# Altium schematic sheet Capstone_Signal_Conditioners_Subsystem_Test_Schematic.SchDoc
size A; SheetNumber: 11; SheetTotal: 15
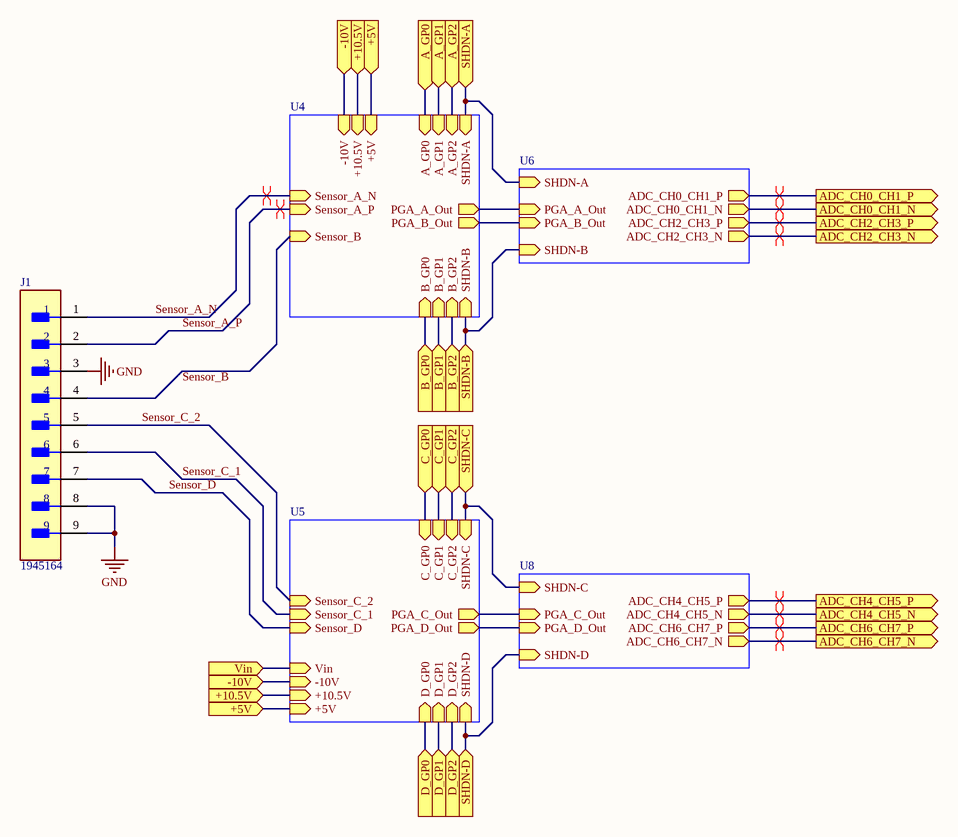
[diagram p0: Capstone_Signal_Conditioners_Subsystem_Test_Schematic.SchDoc]

## Parts
J1  1945164  [1945164]

## Sub-sheets
U4 = THS7002CPWP_Schematic.SchDoc: Sensor_A_P (in), Sensor_A_N (in), A_GP0 (in), A_GP1 (in), A_GP2 (in), PGA_A_Out (out), PGA_B_Out (out), B_GP0 (in), B_GP1 (in), B_GP2 (in), SHDN-A (in), SHDN-B (in), -10V (in), +10.5V (in), +5V (in), Sensor_B (in)
U5 = THS7002CPWP_Schematic_2.SchDoc: C_GP0 (in), D_GP0 (in), C_GP1 (in), C_GP2 (in), D_GP1 (in), D_GP2 (in), SHDN-C (in), SHDN-D (in), PGA_C_Out (out), PGA_D_Out (out), -10V (in), +10.5V (in), +5V (in), Vin (in), Sensor_C_1 (in), Sensor_C_2 (in), Sensor_D (in)
U6 = LTC6362_Schematic.SchDoc: PGA_A_Out (in), PGA_B_Out (in), SHDN-A (in), SHDN-B (in), ADC_CH0_CH1_P (out), ADC_CH0_CH1_N (out), ADC_CH2_CH3_N (out), ADC_CH2_CH3_P (out)
U8 = LTC6362_Schematic_2.SchDoc: SHDN-C (in), SHDN-D (in), ADC_CH6_CH7_N (out), ADC_CH6_CH7_P (out), ADC_CH4_CH5_N (out), ADC_CH4_CH5_P (out), PGA_C_Out (in), PGA_D_Out (in)

## Ports
+5V (in), +10.5V (in), -10V (in), A_GP0 (in), A_GP1 (in), A_GP2 (in), ADC_CH0_CH1_N (out), ADC_CH0_CH1_P (out), ADC_CH2_CH3_N (out), ADC_CH2_CH3_P (out), ADC_CH4_CH5_N (out), ADC_CH4_CH5_P (out), ADC_CH6_CH7_N (out), ADC_CH6_CH7_P (out), B_GP0 (in), B_GP1 (in), B_GP2 (in), C_GP0 (in), C_GP1 (in), C_GP2 (in), D_GP0 (in), D_GP1 (in), D_GP2 (in), SHDN-A (in), SHDN-B (in), SHDN-C (in), SHDN-D (in), Vin (in)

## Nets
GND: J1.3 J1.8 J1.9
+5V: port +5V, sheet U4/+5V, sheet U5/+5V
+10.5V: port +10.5V, sheet U4/+10.5V, sheet U5/+10.5V
-10V: port -10V, sheet U4/-10V, sheet U5/-10V
A_GP0: port A_GP0, sheet U4/A_GP0
A_GP1: port A_GP1, sheet U4/A_GP1
A_GP2: port A_GP2, sheet U4/A_GP2
ADC_CH0_CH1_N: port ADC_CH0_CH1_N, sheet U6/ADC_CH0_CH1_N
ADC_CH0_CH1_P: port ADC_CH0_CH1_P, sheet U6/ADC_CH0_CH1_P
ADC_CH2_CH3_N: port ADC_CH2_CH3_N, sheet U6/ADC_CH2_CH3_N
ADC_CH2_CH3_P: port ADC_CH2_CH3_P, sheet U6/ADC_CH2_CH3_P
ADC_CH4_CH5_N: port ADC_CH4_CH5_N, sheet U8/ADC_CH4_CH5_N
ADC_CH4_CH5_P: port ADC_CH4_CH5_P, sheet U8/ADC_CH4_CH5_P
ADC_CH6_CH7_N: port ADC_CH6_CH7_N, sheet U8/ADC_CH6_CH7_N
ADC_CH6_CH7_P: port ADC_CH6_CH7_P, sheet U8/ADC_CH6_CH7_P
B_GP0: port B_GP0, sheet U4/B_GP0
B_GP1: port B_GP1, sheet U4/B_GP1
B_GP2: port B_GP2, sheet U4/B_GP2
C_GP0: port C_GP0, sheet U5/C_GP0
C_GP1: port C_GP1, sheet U5/C_GP1
C_GP2: port C_GP2, sheet U5/C_GP2
D_GP0: port D_GP0, sheet U5/D_GP0
D_GP1: port D_GP1, sheet U5/D_GP1
D_GP2: port D_GP2, sheet U5/D_GP2
Sensor_A_N: J1.1 ; sheet U4/Sensor_A_N
Sensor_A_P: J1.2 ; sheet U4/Sensor_A_P
Sensor_C_1: J1.6 ; sheet U5/Sensor_C_1
Sensor_C_2: J1.5 ; sheet U5/Sensor_C_2
Sensor_D: J1.7 ; sheet U5/Sensor_D
SHDN-A: port SHDN-A, sheet U4/SHDN-A, sheet U6/SHDN-A
SHDN-B: port SHDN-B, sheet U4/SHDN-B, sheet U6/SHDN-B
SHDN-C: port SHDN-C, sheet U5/SHDN-C, sheet U8/SHDN-C
SHDN-D: port SHDN-D, sheet U5/SHDN-D, sheet U8/SHDN-D
Vin: port Vin, sheet U5/Vin
NetJ1_4: J1.4 ; sheet U4/Sensor_B
(unnamed): sheet U4/PGA_A_Out, sheet U6/PGA_A_Out
(unnamed): sheet U4/PGA_B_Out, sheet U6/PGA_B_Out
(unnamed): sheet U5/PGA_C_Out, sheet U8/PGA_C_Out
(unnamed): sheet U5/PGA_D_Out, sheet U8/PGA_D_Out

## Layout directives
differential pair: ADC_CH0_CH1_N, ADC_CH0_CH1_P, ADC_CH2_CH3_N, ADC_CH2_CH3_P, ADC_CH4_CH5_N, ADC_CH4_CH5_P, ADC_CH6_CH7_N, ADC_CH6_CH7_P, Sensor_A_N, Sensor_A_P

## Notes on the sheet
- Labels drawn without touching a wire or pin: Sensor_B

## Library data of the parts
J1 = 1945164: TERM BLOCK HDR 9POS VERT 3.5MM; Manufacturer Part Number: 4-644456-0; Manufacturer: TE Connectivity; Current Rating: 5A; Conn Gender: Male; Number Of Contacts: 10; Conn Orientation: Vertical; Voltage Rating: 250V; Number Of Rows: 1; Device Class L3: unset; Octopart: https://octopart.com/4-644456-0-te+connectivity-39514173; Pitch: 3.5mm; Mouser Description: TERM BLOCK HDR 9POS VERT 3.5MM; ComponentLink2Description: Datasheet; Height: 0.408inch; Package: 4-644456-0; RoHS: TRUE; Temperature Range High: +105°C; Digikey Description: CONN HEADER VERT 10POS 2.54MM; Temperature: -55°C to +105°C; Device Class L2: Headers and Wire Housings; Automotive: No; Lead Free: Yes; Contact Material: Tin; Temperature Range Low: -55°C; Footprint Url: https://www.te.com/commerce/DocumentDelivery/DDEController?Action=showdoc&DocId=Customer+Drawing%7F644456%7FD2%7Fpdf%7FEnglish%7FENG_CD_644456_D2.pdf%7F4-644456-0; Device Class L1: Connectors; Category: Conn; ComponentLink2URL: https://media.digikey.com/pdf/Data%20Sheets/Phoenix%20Contact%20PDFs/Combicon%20Compact%20Series.pdf